# Altium schematic sheet FMC_HPC_UFL_DEBUG_TP_SMA.SchDoc: 8 SMA connector and U.FL connectors JA .. JH (4 x 2 array)
size A4; Date: 13.12.2024; ApprovedBy: PFH; CompanyName: IAM Electronic GmbH; DrawnBy: PFH; Engineer: PFH; DocumentNumber: 4; Revision: A; SheetNumber: 4; SheetTotal: 9; Projekt: FMC HPC-U.FL Debug Board; Website: www.fmchub.com
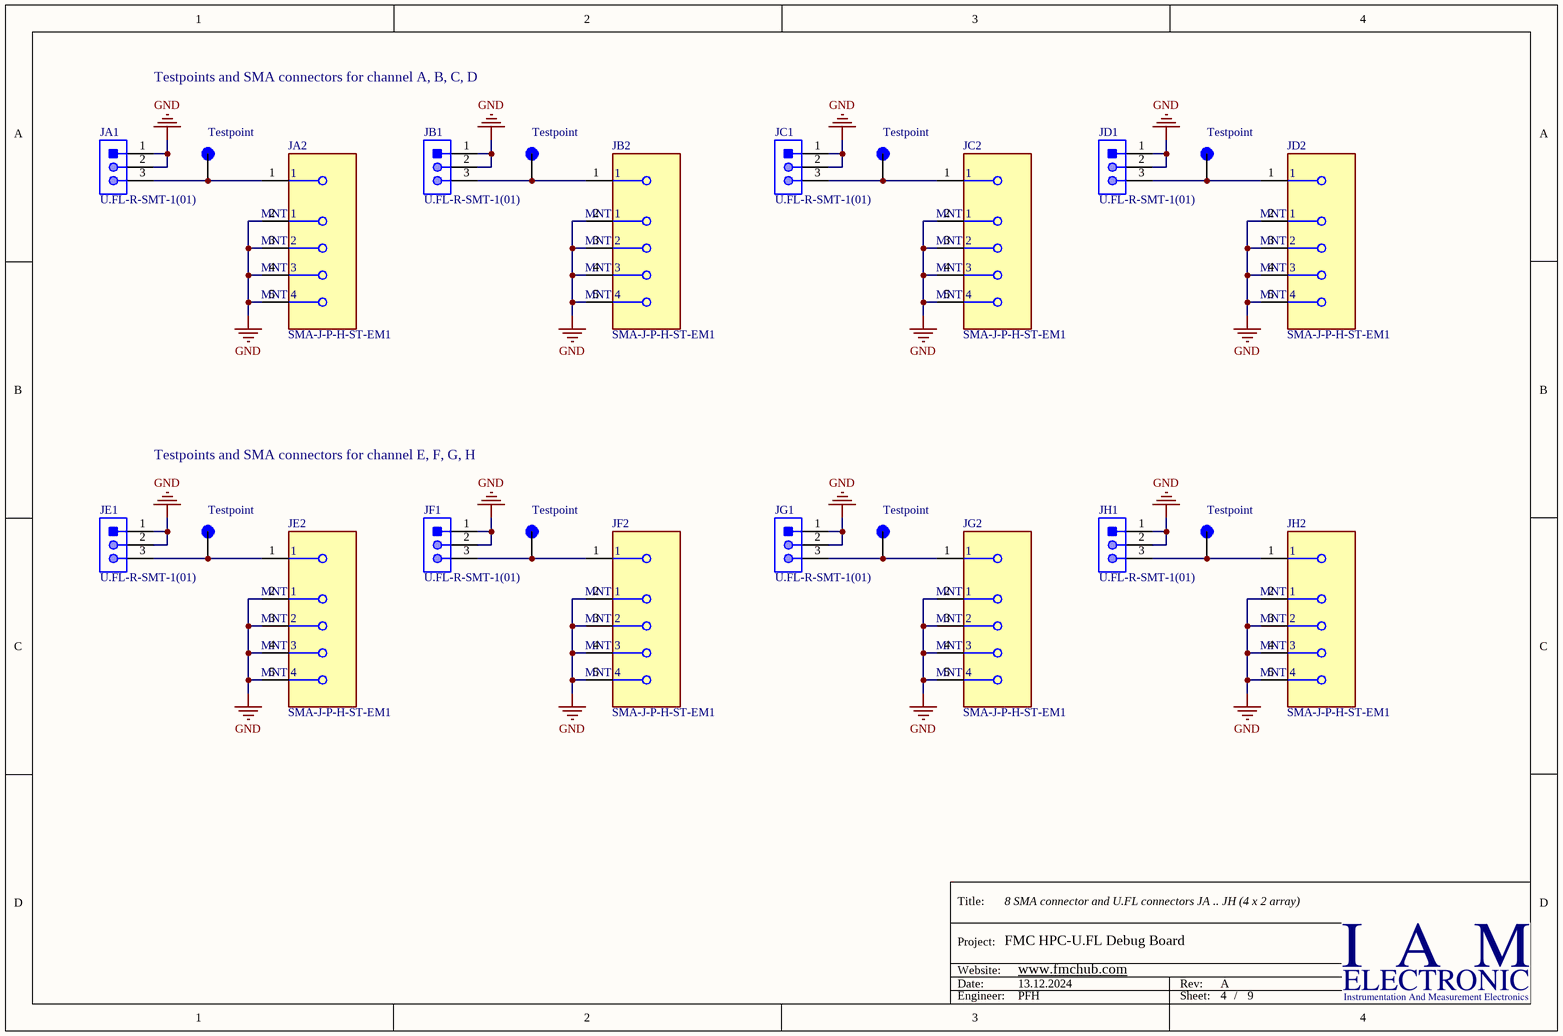
[diagram p0: FMC_HPC_UFL_DEBUG_TP_SMA.SchDoc]

## Parts
JA1  U.FL-R-SMT-1(01)  [HRS-U.FL-R-SMT-3_V]
JA2  SMA-J-P-H-ST-EM1  [FP-SMA-J-P-H-ST-EM1-MFG]
JB1  U.FL-R-SMT-1(01)  [HRS-U.FL-R-SMT-3_V]
JB2  SMA-J-P-H-ST-EM1  [FP-SMA-J-P-H-ST-EM1-MFG]
JC1  U.FL-R-SMT-1(01)  [HRS-U.FL-R-SMT-3_V]
JC2  SMA-J-P-H-ST-EM1  [FP-SMA-J-P-H-ST-EM1-MFG]
JD1  U.FL-R-SMT-1(01)  [HRS-U.FL-R-SMT-3_V]
JD2  SMA-J-P-H-ST-EM1  [FP-SMA-J-P-H-ST-EM1-MFG]
JE1  U.FL-R-SMT-1(01)  [HRS-U.FL-R-SMT-3_V]
JE2  SMA-J-P-H-ST-EM1  [FP-SMA-J-P-H-ST-EM1-MFG]
JF1  U.FL-R-SMT-1(01)  [HRS-U.FL-R-SMT-3_V]
JF2  SMA-J-P-H-ST-EM1  [FP-SMA-J-P-H-ST-EM1-MFG]
JG1  U.FL-R-SMT-1(01)  [HRS-U.FL-R-SMT-3_V]
JG2  SMA-J-P-H-ST-EM1  [FP-SMA-J-P-H-ST-EM1-MFG]
JH1  U.FL-R-SMT-1(01)  [HRS-U.FL-R-SMT-3_V]
JH2  SMA-J-P-H-ST-EM1  [FP-SMA-J-P-H-ST-EM1-MFG]
TPA1  Testpoint  [KEYSTONE_5095]
TPB1  Testpoint  [KEYSTONE_5095]
TPC1  Testpoint  [KEYSTONE_5095]
TPD1  Testpoint  [KEYSTONE_5095]
TPE1  Testpoint  [KEYSTONE_5095]
TPF1  Testpoint  [KEYSTONE_5095]
TPG2  Testpoint  [KEYSTONE_5095]
TPH1  Testpoint  [KEYSTONE_5095]

## Nets
GND: JA1.1 JA1.2 JA2.2(MNT_1) JA2.3(MNT_2) JA2.4(MNT_3) JA2.5(MNT_4) JB1.1 JB1.2 JB2.2(MNT_1) JB2.3(MNT_2) JB2.4(MNT_3) JB2.5(MNT_4) JC1.1 JC1.2 JC2.2(MNT_1) JC2.3(MNT_2) JC2.4(MNT_3) JC2.5(MNT_4) JD1.1 JD1.2 JD2.2(MNT_1) JD2.3(MNT_2) JD2.4(MNT_3) JD2.5(MNT_4) JE1.1 JE1.2 JE2.2(MNT_1) JE2.3(MNT_2) JE2.4(MNT_3) JE2.5(MNT_4) JF1.1 JF1.2 JF2.2(MNT_1) JF2.3(MNT_2) JF2.4(MNT_3) JF2.5(MNT_4) JG1.1 JG1.2 JG2.2(MNT_1) JG2.3(MNT_2) JG2.4(MNT_3) JG2.5(MNT_4) JH1.1 JH1.2 JH2.2(MNT_1) JH2.3(MNT_2) JH2.4(MNT_3) JH2.5(MNT_4)
NetJA1_3: JA1.3 JA2.1 TPA1.1(TP)
NetJB1_3: JB1.3 JB2.1 TPB1.1(TP)
NetJC1_3: JC1.3 JC2.1 TPC1.1(TP)
NetJD1_3: JD1.3 JD2.1 TPD1.1(TP)
NetJE1_3: JE1.3 JE2.1 TPE1.1(TP)
NetJF1_3: JF1.3 JF2.1 TPF1.1(TP)
NetJG1_3: JG1.3 JG2.1 TPG2.1(TP)
NetJH1_3: JH1.3 JH2.1 TPH1.1(TP)

## Notes on the sheet
- Testpoints and SMA connectors for channel A, B, C, D
- Testpoints and SMA connectors for channel E, F, G, H
- Title:
- Project:
- Date:
- Website:
- Rev:
- Engineer:
- Sheet:
- /

## Library data of the parts
JA1 JB1 JC1 JD1 JE1 JF1 JG1 JH1 = CMP-2000-05153-1: Ultra Small Coaxial Connector, 6 GHz, -40 to 90 degC, 3-Pin SMD, RoHS, Bulk; Manufacturer: Hirose Electric; Connector Style: U.FL; Impedance: 50Ohm; Dielectric Material: LiquidCrystalPolymer(LCP); Minimum Quantity: UltraMiniatureCoaxial; Online Catalog: U.FLSeries; Featured Product: HiroseU.FLSeries; Frequency - Max: 6GHz; Other Names: H122041 / U.FL-R-SMT-1(01)-ND; Contact Termination: Solder; Body Material: PhosphorBronze; Connector Type: Jack,MalePin; Body Finish: Silver; Center Contact Plating: Gold; Manufacturer URL: https://www.hirose.com; Family: CoaxialConnectors(RF); Fastening Type: Snap-On; Unit PriceUSD: U.FL; Series: U.FL; Package Reference: U.FL-R-SMT; Packaging: Bulk; Standard Package: 100; Mounting Type: SurfaceMount; Quantity Available: Bulk; Housing Color: Silver; Package Description: 3-Pin Surface Mount Device, Body 2.6 x 2.6 mm; Category: Connectors,Interconnects; Operating Temperature: -40degC~90degC; Center Contact Material: PhosphorBronze; Dynamic Catalog: U.FLSeries; Datasheet URL: https://datasheet.ciiva.com/26945/getdatasheetpartid-475239-26945414.pdf; Datasheet Version: Feb-09; Shield Termination: Solder; Part: U.FL-R-SMT-1(01); Part2: 331-0472-2 01
JA2 JB2 JC2 JD2 JE2 JF2 JG2 JH2 = CMP-02754-000006-1: CONN SMA JACK STR 50OHM EDGE MNT; Manufacturer: Samtec; Dielectric Material: PTFE; Center Contact Plating: Gold; Max Frequency: 6GHz; Body Material: Brass; Voltage Rating: 335V; Impedance: 50R; Package Quantity: 1; Case/Package: SMA; Max Operating Temperature: 125°C; Fastening Type: Threaded; Orientation: Straight; Depth: 13.33mm; RoHS Compliant: Yes; Length: 6.35mm; Insulation Material: Polytetrafluoroethylene; Termination: Solder; Min Operating Temperature: -65°C; Housing Color: Gold; Contact Plating: Gold; Contact Material: Copper; Connector Type: SMA; Mount: Edge; Series: SMA; Packaging: Tray; Body Plating: Gold; Radiation Hardening: No; Part: SMA-J-P-H-ST-EM1
TPA1 TPB1 TPC1 TPD1 TPE1 TPF1 TPG2 TPH1 = 5095: PC TEST POINT COMPACT; Manufacturer: Keystone Electronics; Part: 5095; Package: None